# EAGLE design Cree_4x4 _Led_Panel_V3 (EAGLE 7.6.0)

## Sheet 1 of 2
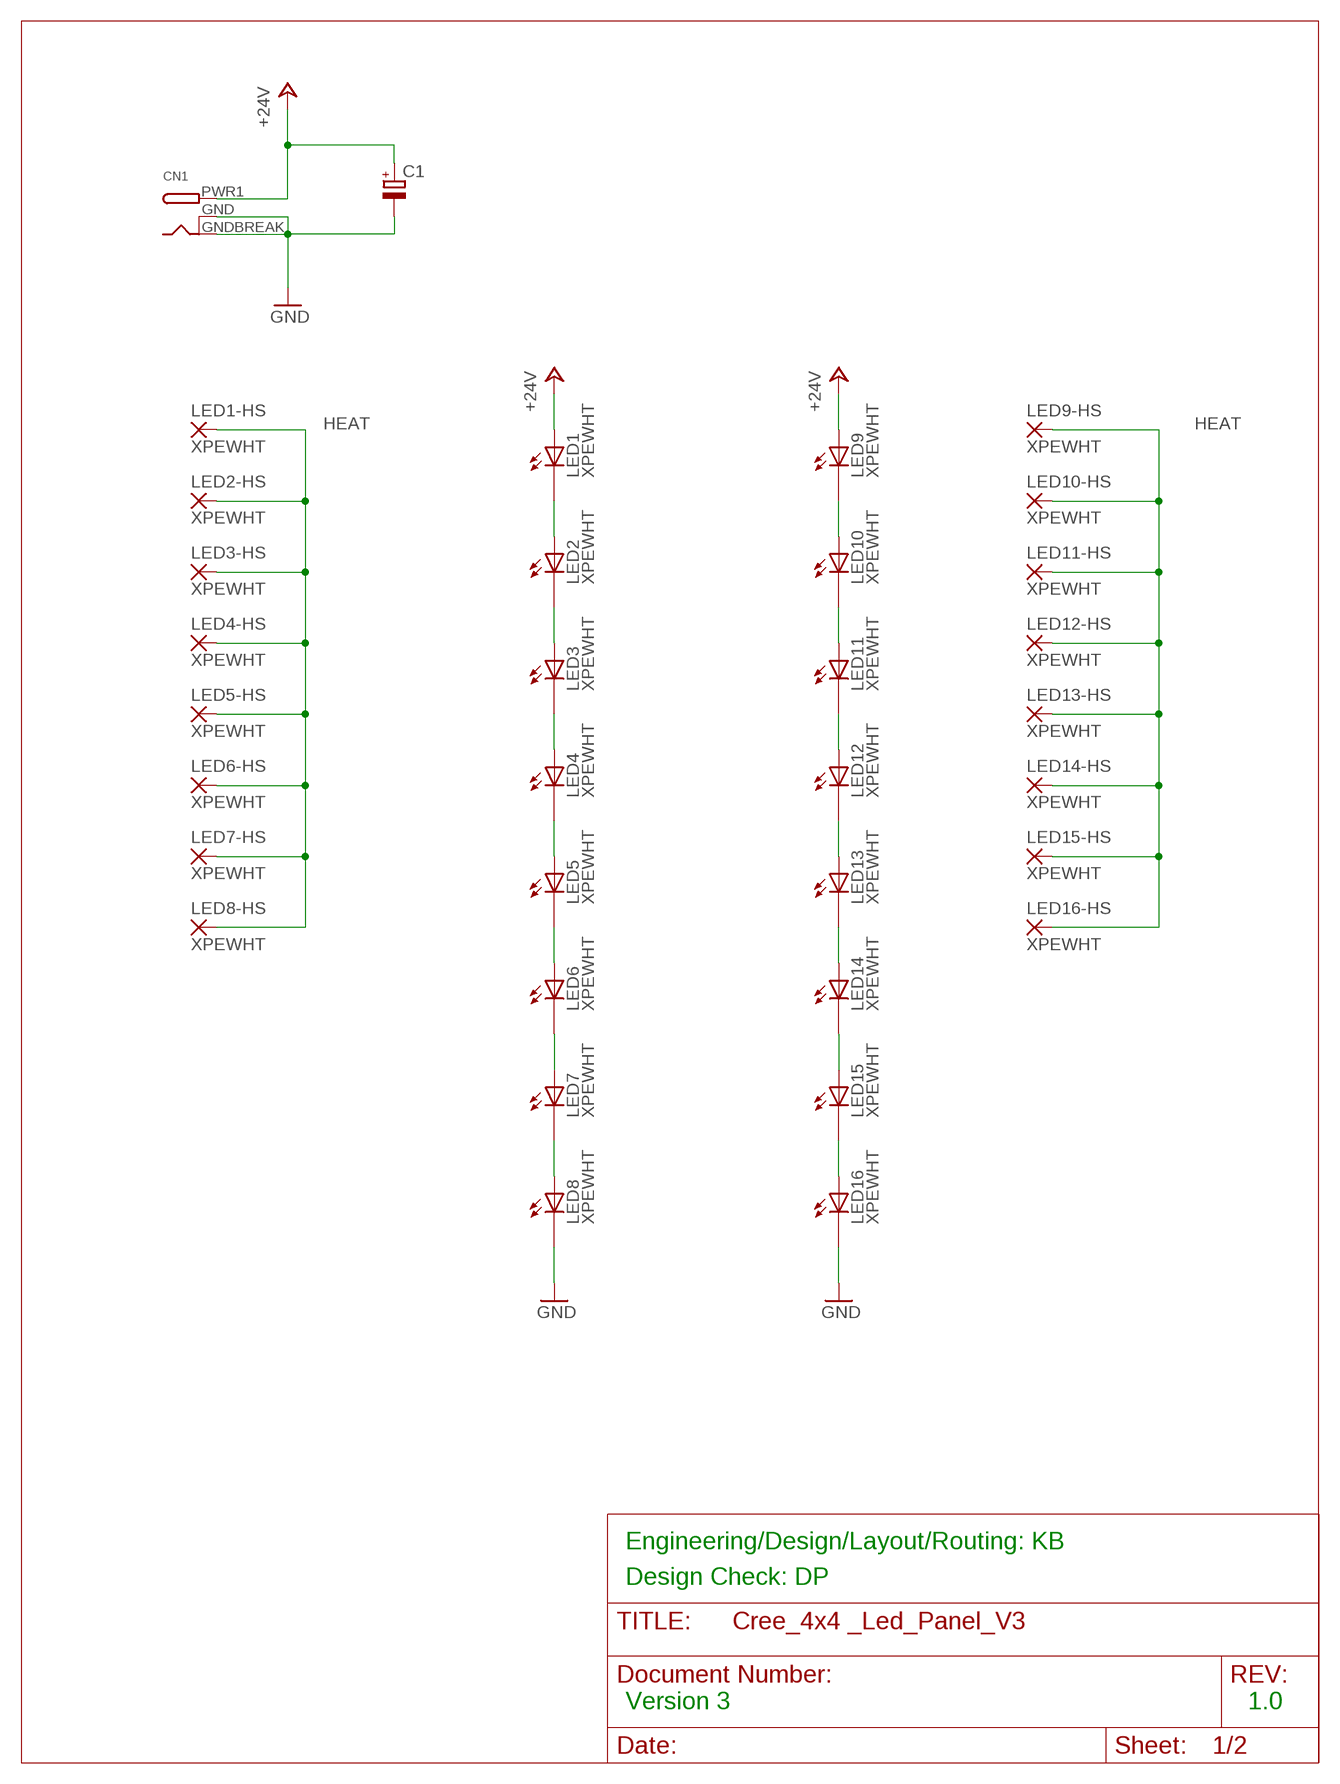
[diagram p0: schematic, sheet 1]

### Parts
C1  CPOL-EUSMCC  [SMC_C]
CN1  DCBARRELSMT  [DCJACK_2MM_SMT]
LED1  XPEWHT  XPEWHT-01-0000-00BC2  [CREE_XLAMP]
LED2  XPEWHT  XPEWHT-01-0000-00BC2  [CREE_XLAMP]
LED3  XPEWHT  XPEWHT-01-0000-00BC2  [CREE_XLAMP]
LED4  XPEWHT  XPEWHT-01-0000-00BC2  [CREE_XLAMP]
LED5  XPEWHT  XPEWHT-01-0000-00BC2  [CREE_XLAMP]
LED6  XPEWHT  XPEWHT-01-0000-00BC2  [CREE_XLAMP]
LED7  XPEWHT  XPEWHT-01-0000-00BC2  [CREE_XLAMP]
LED8  XPEWHT  XPEWHT-01-0000-00BC2  [CREE_XLAMP]
LED9  XPEWHT  XPEWHT-01-0000-00BC2  [CREE_XLAMP]
LED10  XPEWHT  XPEWHT-01-0000-00BC2  [CREE_XLAMP]
LED11  XPEWHT  XPEWHT-01-0000-00BC2  [CREE_XLAMP]
LED12  XPEWHT  XPEWHT-01-0000-00BC2  [CREE_XLAMP]
LED13  XPEWHT  XPEWHT-01-0000-00BC2  [CREE_XLAMP]
LED14  XPEWHT  XPEWHT-01-0000-00BC2  [CREE_XLAMP]
LED15  XPEWHT  XPEWHT-01-0000-00BC2  [CREE_XLAMP]
LED16  XPEWHT  XPEWHT-01-0000-00BC2  [CREE_XLAMP]

### Nets
+24V: C1.+ CN1.PWR1(PWR) LED1.A LED9.A
GND: C1.- CN1.GND(GNDBREAK) CN1.GNDBREAK(GND) LED8.C LED16.C
HEAT: LED1.X(P) LED2.X(P) LED3.X(P) LED4.X(P) LED5.X(P) LED6.X(P) LED7.X(P) LED8.X(P) LED9.X(P) LED10.X(P) LED11.X(P) LED12.X(P) LED13.X(P) LED14.X(P) LED15.X(P) LED16.X(P)
N$1: LED1.C LED2.A
N$2: LED2.C LED3.A
N$3: LED3.C LED4.A
N$4: LED5.C LED6.A
N$5: LED6.C LED7.A
N$6: LED9.C LED10.A
N$7: LED10.C LED11.A
N$8: LED7.C LED8.A
N$9: LED4.C LED5.A
N$10: LED11.C LED12.A
N$11: LED15.C LED16.A
N$12: LED12.C LED13.A
N$13: LED13.C LED14.A
N$14: LED14.C LED15.A
Unconnected: LED1.A@1(A) LED1.C@1(C) LED2.A@1(A) LED2.C@1(C) LED3.A@1(A) LED3.C@1(C) LED4.A@1(A) LED4.C@1(C) LED5.A@1(A) LED5.C@1(C) LED6.A@1(A) LED6.C@1(C) LED7.A@1(A) LED7.C@1(C) LED8.A@1(A) LED8.C@1(C) LED9.A@1(A) LED9.C@1(C) LED10.A@1(A) LED10.C@1(C) LED11.A@1(A) LED11.C@1(C) LED12.A@1(A) LED12.C@1(C) LED13.A@1(A) LED13.C@1(C) LED14.A@1(A) LED14.C@1(C) LED15.A@1(A) LED15.C@1(C) LED16.A@1(A) LED16.C@1(C)

### Notes on the sheet
- Engineering/Design/Layout/Routing: KB
- Design Check: DP
- Version 3 | 1.0

## Sheet 2 of 2
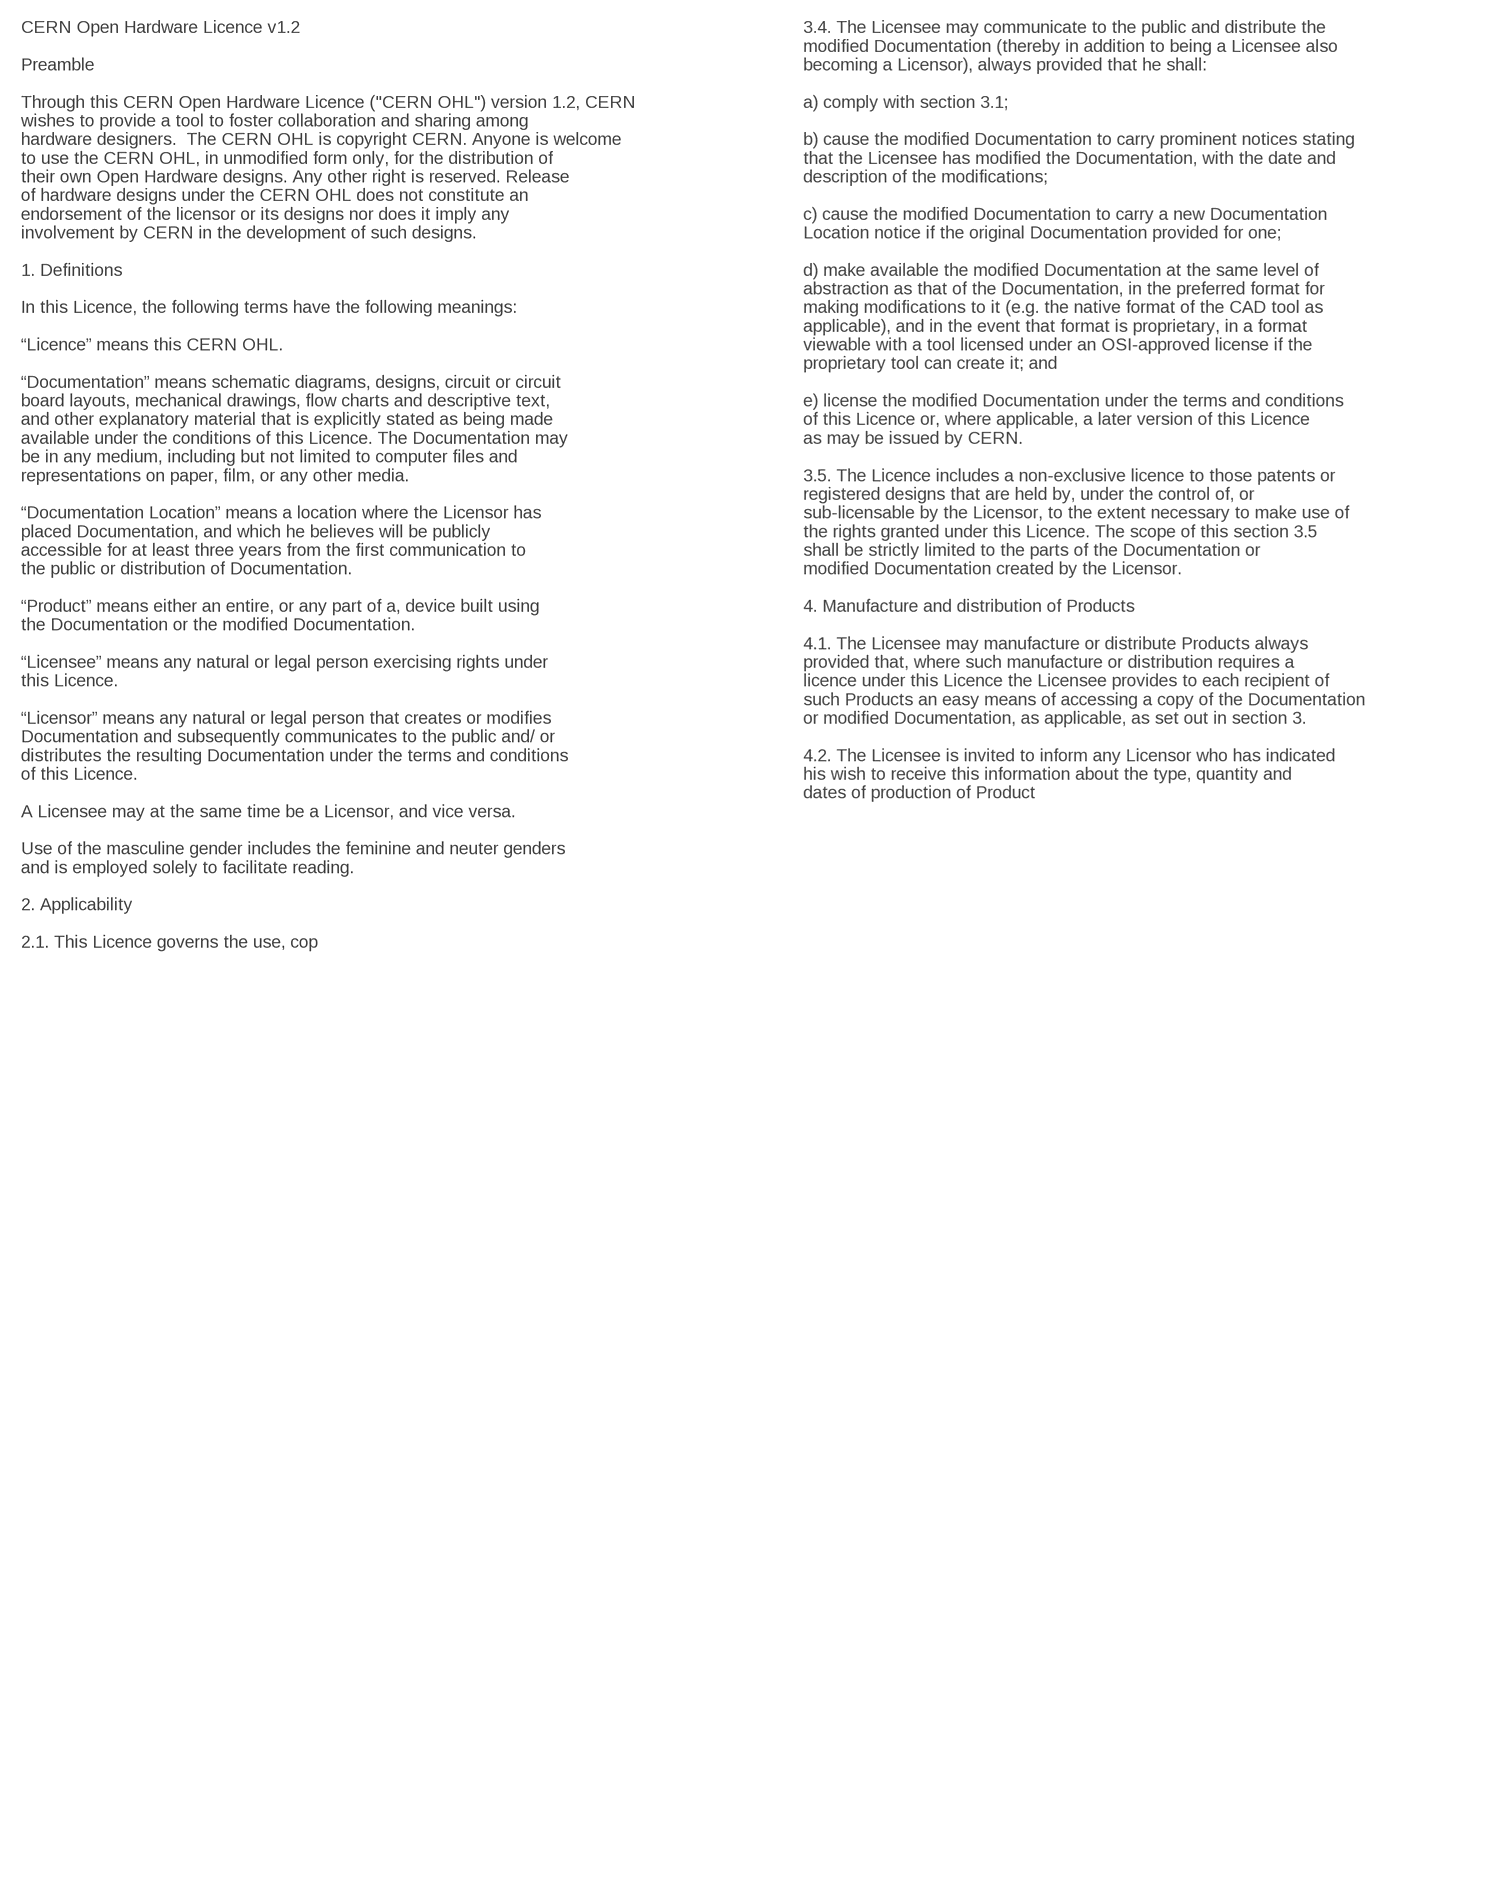
[diagram p1: schematic, sheet 2]

### Notes on the sheet
- CERN Open Hardware Licence v1.2 
  
  Preamble
  
  Through this CERN Open Hardware Licence ("CERN OHL") version 1.2, CERN
  wishes to provide a tool to foster collaboration and sharing among
  hardware designers.  The CERN OHL is copyright CERN. Anyone is welcome
  to use the CERN OHL, in unmodified form only, for the distribution of
  their own Open Hardware designs. Any other right is reserved. Release
  of hardware designs under the CERN OHL does not constitute an
  endorsement of the licensor or its designs nor does it imply any
  involvement by CERN in the development of such designs.
  
  1. Definitions
  
  In this Licence, the following terms have the following meanings:
   
  “Licence” means this CERN OHL.
  
  “Documentation” means schematic diagrams, designs, circuit or circuit
  board layouts, mechanical drawings, flow charts and descriptive text,
  and other explanatory material that is explicitly stated as being made
  available under the conditions of this Licence. The Documentation may
  be in any medium, including but not limited to computer files and
  representations on paper, film, or any other media.
  
  “Documentation Location” means a location where the Licensor has
  placed Documentation, and which he believes will be publicly
  accessible for at least three years from the first communication to
  the public or distribution of Documentation.
  
  “Product” means either an entire, or any part of a, device built using
  the Documentation or the modified Documentation.
  
  “Licensee” means any natural or legal person exercising rights under
  this Licence.
  
  “Licensor” means any natural or legal person that creates or modifies
  Documentation and subsequently communicates to the public and/ or
  distributes the resulting Documentation under the terms and conditions
  of this Licence.
  
  A Licensee may at the same time be a Licensor, and vice versa. 
  
  Use of the masculine gender includes the feminine and neuter genders
  and is employed solely to facilitate reading.
  
  2. Applicability
  
  2.1. This Licence governs the use, copying, modification,
  communication to the public and distribution of the Documentation, and
  the manufacture and distribution of Products. By exercising any right
  granted under this Licence, the Licensee irrevocably accepts these
  terms and conditions.
  
  2.2. This Licence is granted by the Licensor directly to the Licensee,
  and shall apply worldwide and without limitation in time. The Licensee
  may assign his licence rights or grant sub-licences.
  
  2.3. This Licence does not extend to software, firmware, or code
  loaded into programmable devices which may be used in conjunction with
  the Documentation, the modified Documentation or with Products, unless
  such software, firmware, or code is explicitly expressed to be subject
  to this Licence. The use of such software, firmware, or code is
  otherwise subject to the applicable licence terms and conditions.
  
  3. Copying, modification, communication to the public and distribution
  of the Documentation
  
  3.1. The Licensee shall keep intact all copyright and trademarks
  notices, all notices referring to Documentation Location, and all
  notices that refer to this Licence and to the disclaimer of warranties
  that are included in the Documentation. He shall include a copy
  thereof in every copy of the Documentation or, as the case may be,
  modified Documentation, that he communicates to the public or
  distributes.
  
  3.2. The Licensee may copy, communicate to the public and distribute
  verbatim copies of the Documentation, in any medium, subject to the
  requirements specified in section 3.1.
  
  3.3. The Licensee may modify the Documentation or any portion thereof
  provided that upon modification of the Documentation, the Licensee
  shall make the modified Documentation available from a Documentation
  Location such that it can be easily located by an original Licensor
  once the Licensee communicates to the public or distributes the
  modified Documentation under section 3.4, and, where required by
  section 4.1, by a recipient of a Product. However, the Licensor shall
  not assert his rights under the foregoing proviso unless or until a
  Product is distributed.
- 3.4. The Licensee may communicate to the public and distribute the
  modified Documentation (thereby in addition to being a Licensee also
  becoming a Licensor), always provided that he shall:
  
  a) comply with section 3.1;
  
  b) cause the modified Documentation to carry prominent notices stating
  that the Licensee has modified the Documentation, with the date and
  description of the modifications;
  
  c) cause the modified Documentation to carry a new Documentation
  Location notice if the original Documentation provided for one;
  
  d) make available the modified Documentation at the same level of
  abstraction as that of the Documentation, in the preferred format for
  making modifications to it (e.g. the native format of the CAD tool as
  applicable), and in the event that format is proprietary, in a format
  viewable with a tool licensed under an OSI-approved license if the
  proprietary tool can create it; and
  
  e) license the modified Documentation under the terms and conditions
  of this Licence or, where applicable, a later version of this Licence
  as may be issued by CERN.
  
  3.5. The Licence includes a non-exclusive licence to those patents or
  registered designs that are held by, under the control of, or
  sub-licensable by the Licensor, to the extent necessary to make use of
  the rights granted under this Licence. The scope of this section 3.5
  shall be strictly limited to the parts of the Documentation or
  modified Documentation created by the Licensor.
  
  4. Manufacture and distribution of Products
  
  4.1. The Licensee may manufacture or distribute Products always
  provided that, where such manufacture or distribution requires a
  licence under this Licence the Licensee provides to each recipient of
  such Products an easy means of accessing a copy of the Documentation
  or modified Documentation, as applicable, as set out in section 3.
  
  4.2. The Licensee is invited to inform any Licensor who has indicated
  his wish to receive this information about the type, quantity and
  dates of production of Products the Licensee has (had) manufactured
  
  5. Warranty and liability
  
  5.1. DISCLAIMER – The Documentation and any modified Documentation are
  provided "as is" and any express or implied warranties, including, but
  not limited to, implied warranties of merchantability, of satisfactory
  quality, non-infringement of third party rights, and fitness for a
  particular purpose or use are disclaimed in respect of the
  Documentation, the modified Documentation or any Product. The Licensor
  makes no representation that the Documentation, modified
  Documentation, or any Product, does or will not infringe any patent,
  copyright, trade secret or other proprietary right. The entire risk as
  to the use, quality, and performance of a Product shall be with the
  Licensee and not the Licensor. This disclaimer of warranty is an
  essential part of this Licence and a condition for the grant of any
  rights granted under this Licence. The Licensee warrants that it does
  not act in a consumer capacity.
  
  5.2. LIMITATION OF LIABILITY – The Licensor shall have no liability
  for direct, indirect, special, incidental, consequential, exemplary,
  punitive or other damages of any character including, without
  limitation, procurement of substitute goods or services, loss of use,
  data or profits, or business interruption, however caused and on any
  theory of contract, warranty, tort (including negligence), product
  liability or otherwise, arising in any way in relation to the
  Documentation, modified Documentation and/or the use, manufacture or
  distribution of a Product, even if advised of the possibility of such
  damages, and the Licensee shall hold the Licensor(s) free and harmless
  from any liability, costs, damages, fees and expenses, including
  claims by third parties, in relation to such use.
  
  6. General
  
  6.1. Except for the rights explicitly granted hereunder, this Licence
  does not imply or represent any transfer or assignment of intellectual
  property rights to the Licensee.
  
  6.2. The Licensee shall not use or make reference to any of the names
  (including acronyms and abbreviations), images, or logos under which
  the Licensor is known, save in so far as required to comply with
  section 3. Any such permitted use or reference shall be factual and
  shall in no event suggest any kind of endorsement by the Licensor or
  its personnel of the modified Documentation or any Product, or any
  kind of implication by the Licensor or its personnel in the
  preparation of the modified Documentation or Product.
  
  6.3. CERN may publish updated versions of this Licence which retain
  the same general provisions as this version, but differ in detail so
  far this is required and reasonable. New versions will be published
  with a unique version number.
  
  6.4. This Licence shall terminate with immediate effect, upon written
  notice and without involvement of a court if the Licensee fails to
  comply with any of its terms and conditions, or if the Licensee
  initiates legal action against Licensor in relation to this
  Licence. Section 5 shall continue to apply.

## Library data of the parts
C1 = rcl:CPOL-EU: POLARIZED CAPACITOR, European symbol
CN1 = adafruit:DCBARREL: 2.0mm DC Barrel Jack DCJACK_2MM_PTH - Through Hole Jack (4UConnector: 05537)
LED1-LED16 = KippKitts:XPEWHT-: Cree® XLamp® XP-E LEDs Source: www.cree.com/xlamp .. XLampXP-E.pdf

## Board
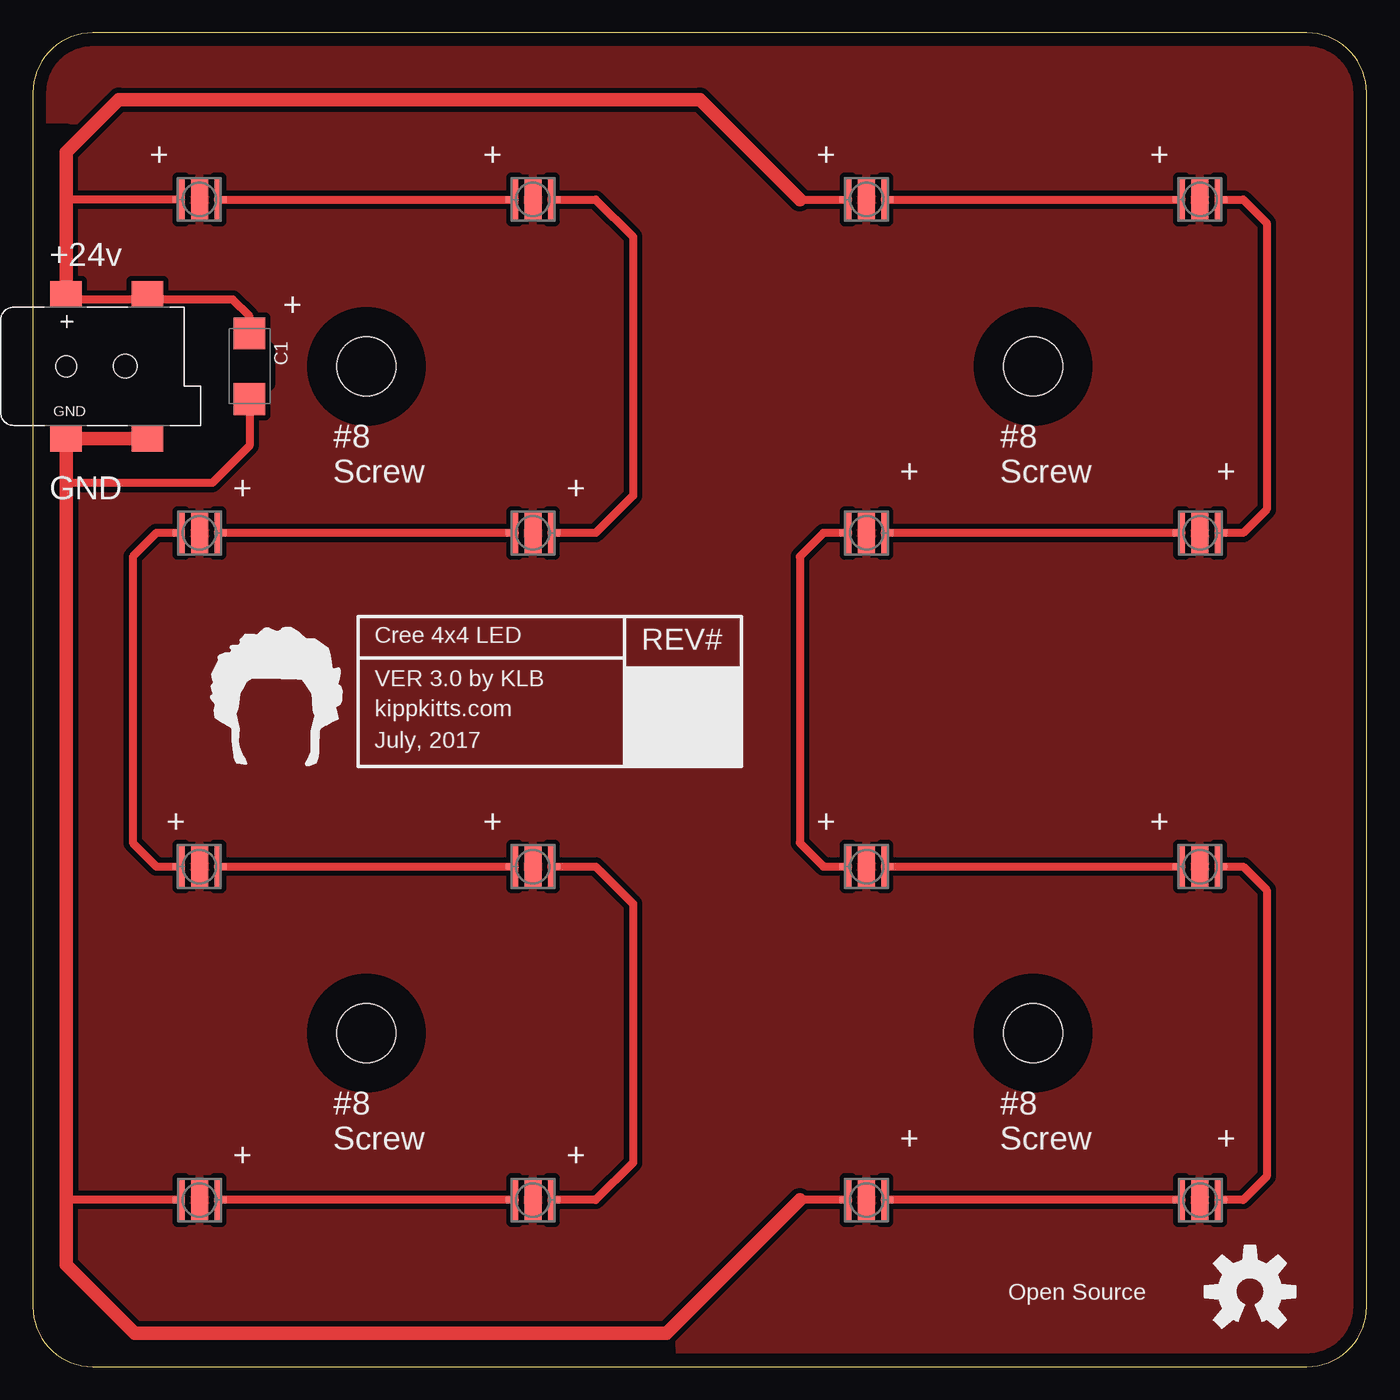
[diagram p2: board, top side]

Size 101.6 x 101.6 mm. Coordinates in mm from the lower left corner, seen from the top.
Outline: 0,97.02 0,4.58 arc90 4.58,0 97.02,0 arc90 101.6,4.58 101.6,97.02 arc90 97.02,101.6 4.58,101.6 arc90 0,97.02
Copper layers (1*16): Top 0.035mm / dielectric 1.5mm / Bottom 0.035mm
Design rules "default": minimum track width 10mil, minimum drill 24mil, track to track 8mil, track to pad 8mil, pad to pad 8mil, via to via 8mil, smd to smd 8mil, copper to edge 40mil, drill to drill 8mil, minimum pad ring 10mil, minimum via ring 8mil, stop-mask expansion 4mil, vias tented up to drill 0mil, thermal gap 10mil
Holes 4.5 mm at 25.4,76.2 76.2,76.2 76.2,25.4 25.4,25.4
tRestrict: area 72.4,21.6 to 80,29.2; area 72.4,72.4 to 80,80; area 21.6,72.4 to 29.2,80; area 21.6,21.6 to 29.2,29.2; 3 lines

### Footprints (pad centres in the part's own frame; a part is rotated, then mirrored left to right if it is on the bottom)
SMC_C = smd 2.4 x 2.4: + -2.5,0; - 2.5,0
DCJACK_2MM_SMT = smd 2.4 x 2: GND 0,-5.5; GNDBREAK 6.2,-5.5; PWR1 0,5.5; PWR2 6.2,5.5 | hole 1.6: 0,0 | hole 1.8: 4.5,0
CREE_XLAMP = smd 0.5 x 3.3: A -1.4,0; C 1.4,0 | smd 0.45 x 0.5: A@1 -1.825,0; C@1 1.825,0 | smd 1.3 x 3.3: X 0,0

### Placement (x,y rotation side)
C1  16.51,76.2 270 top
CN1  2.54,76.2 0 top
KKLOGO  [TOP_DOCU_10MM]  13.34,45.72 0 top
LED1  12.7,88.9 0 top
LED2  38.1,88.9 0 top
LED3  38.1,63.5 180 top
LED4  12.7,63.5 180 top
LED5  12.7,38.1 0 top
LED6  38.1,38.1 0 top
LED7  38.1,12.7 180 top
LED8  12.7,12.7 180 top
LED9  63.5,88.9 0 top
LED10  88.9,88.9 0 top
LED11  88.9,63.5 180 top
LED12  63.5,63.5 180 top
LED13  63.5,38.1 0 top
LED14  88.9,38.1 0 top
LED15  88.9,12.7 180 top
LED16  63.5,12.7 180 top
U$1  OSHW-LOGOL  [OSHW-LOGO-L]  92.71,5.71 0 top
U$2  [LICENSE_CERN1.2]  0,-24.13 0 top  (outside the outline)
U$3  [DISCLAIMER]  0,-19.05 0 top  (outside the outline)

### Tracks (layer width: path | path; a pad name or v marks a point on that pad's centre or on a via)
+24V
  Top 0.61: 58.42,88.9 LED9.A | LED1.A 2.54,88.9 | C1.+ 16.51,80.01 15.24,81.28 2.96,81.28 CN1.PWR1
  Top 1.016: CN1.PWR1 2.54,88.9 2.54,92.5 6.56,96.52 50.8,96.52 58.42,88.9
GND
  Top 0.61: LED8.C 2.54,12.7 | LED16.C 58.42,12.7 | C1.- 16.51,70.15 13.67,67.31 2.54,67.31
  Top 1.016: 58.42,12.7 48.26,2.54 7.78,2.54 2.54,7.78 2.54,12.7 2.54,67.31 CN1.GND CN1.GNDBREAK
HEAT
  pour Top (isolate 0.406): -2.54,104.14 105.41,104.14 105.41,-2.54 -2.54,-2.54
N$1
  Top 0.61: LED1.C LED2.A
N$2
  Top 0.61: LED2.C 42.88,88.9 45.72,86.06 45.72,66.34 42.88,63.5 LED3.A
N$3
  Top 0.61: LED3.C LED4.A
N$4
  Top 0.61: LED5.C LED6.A
N$5
  Top 0.61: LED6.C 42.88,38.1 45.72,35.26 45.72,15.54 42.88,12.7 LED7.A
N$6
  Top 0.61: LED9.C LED10.A
N$7
  Top 0.61: LED10.C 92.18,88.9 93.98,87.1 93.98,65.3 92.18,63.5 LED11.A
N$8
  Top 0.61: LED7.C LED8.A
N$9
  Top 0.61: LED4.C 9.42,63.5 7.62,61.7 7.62,39.9 9.42,38.1 LED5.A
N$10
  Top 0.61: LED11.C LED12.A
N$11
  Top 0.61: LED15.C LED16.A
N$12
  Top 0.61: LED12.C 60.22,63.5 58.42,61.7 58.42,39.9 60.22,38.1 LED13.A
N$13
  Top 0.61: LED13.C LED14.A
N$14
  Top 0.61: LED14.C 92.18,38.1 93.98,36.3 93.98,14.5 92.18,12.7 LED15.A

### Text on the board
tPlace: + | Cree 4x4 LED | REV# | VER 3.0 by KLB | kippkitts.com | July, 2017 | Open Source
tNames: + | + | + | + | +24v | #8 / Screw | + | #8 / Screw | + | GND | + | + | + | + | + | + | #8 / Screw | + | #8 / Screw | + | + | +